# EAGLE design Genus_MainBoard_Dev v.1.0 (EAGLE 9.5.2)
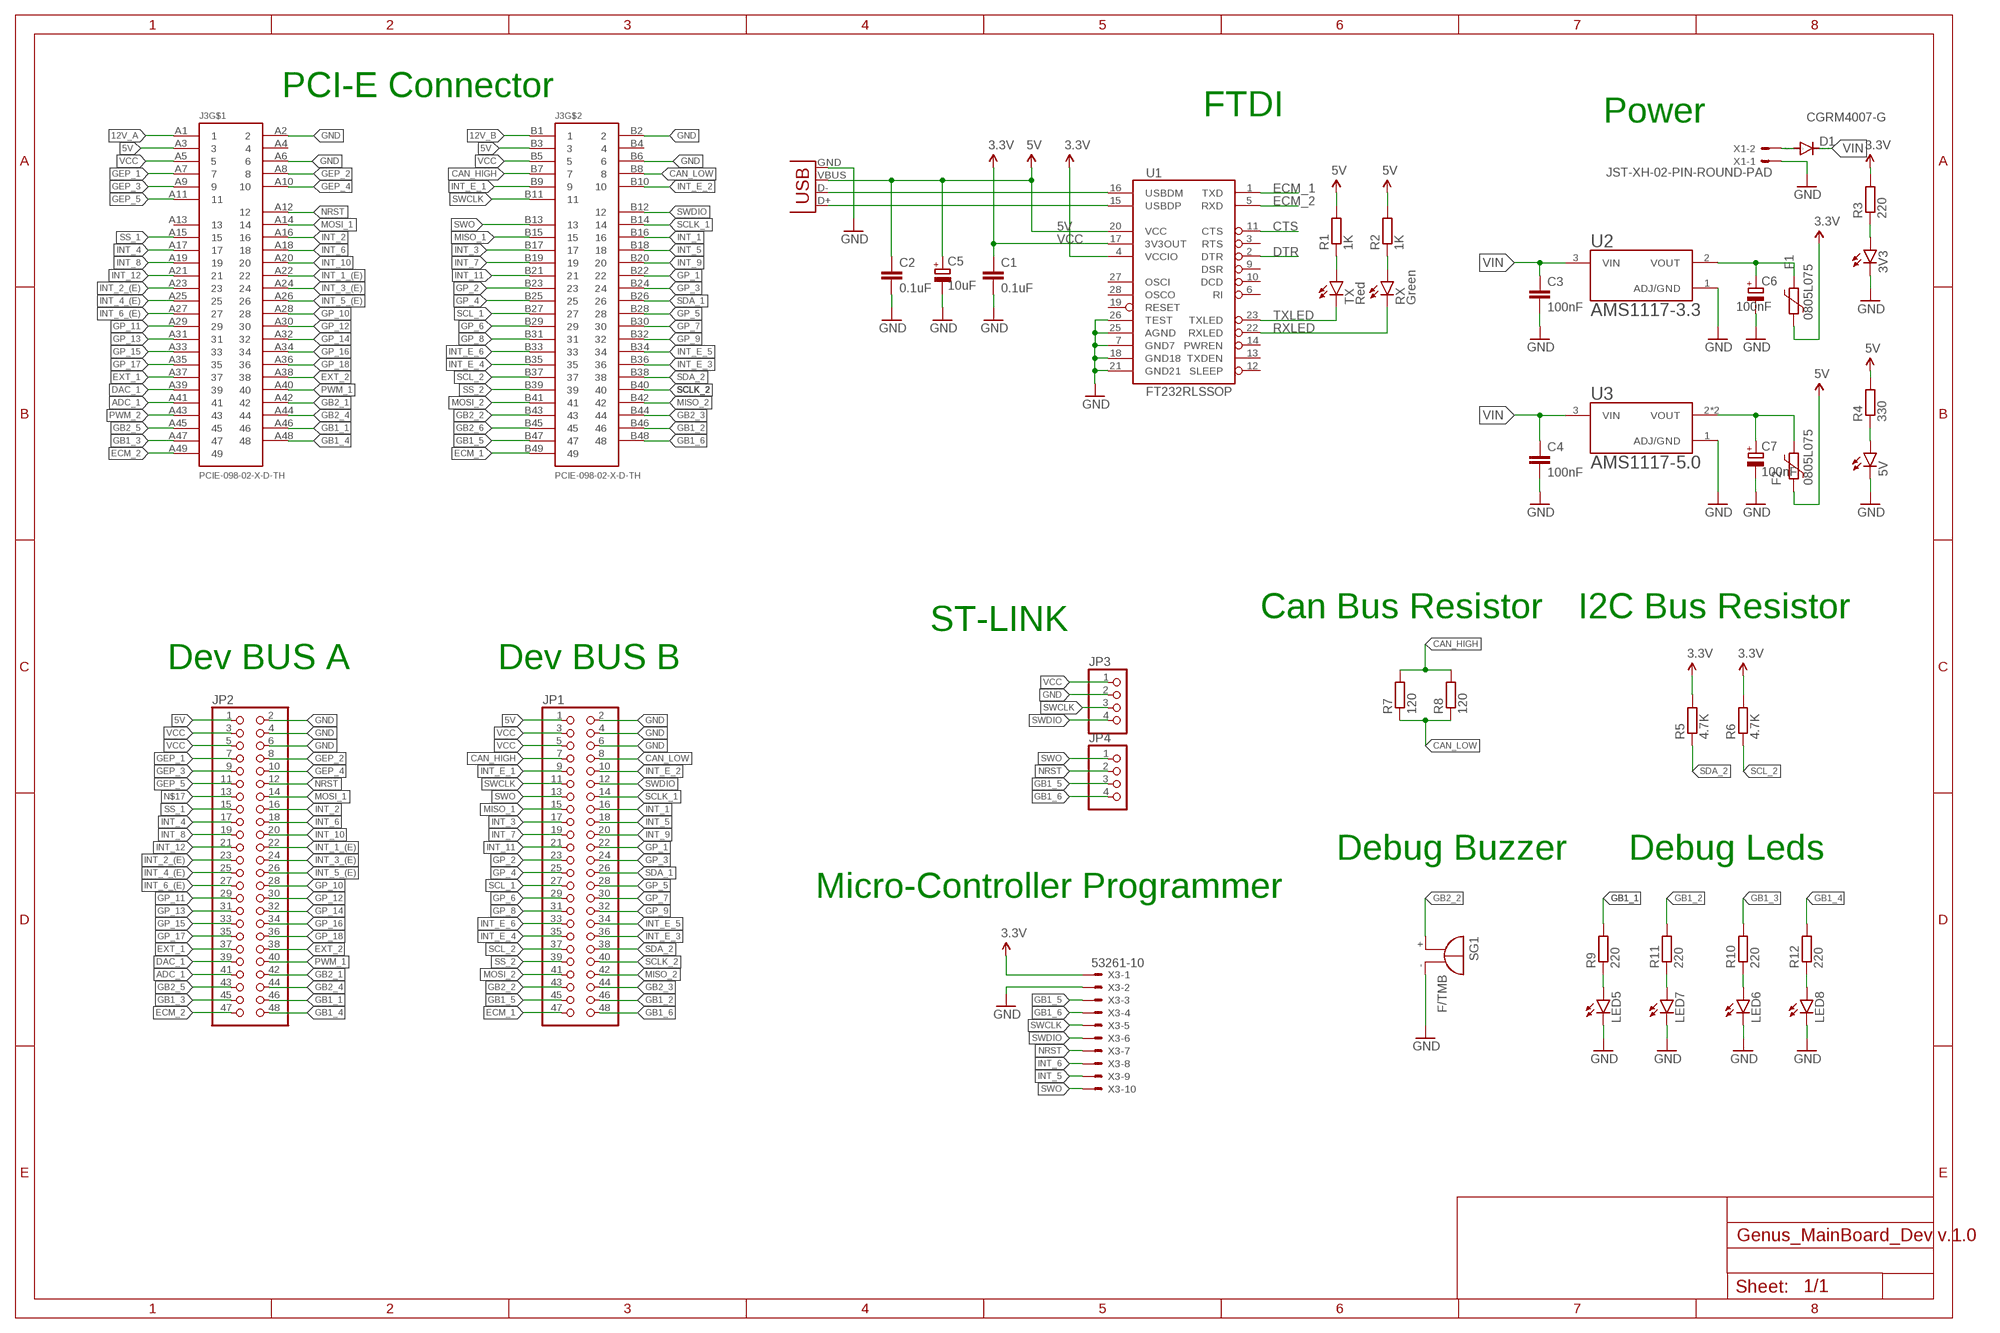
[diagram p0: schematic, sheet 1]

## Parts
3V3  LEDCHIPLED_0805  [CHIPLED_0805]
5V  LEDCHIPLED_0805  [CHIPLED_0805]
C1  0.1uF  C-EUC0805  [C0805]
C2  0.1uF  C-EUC0805  [C0805]
C3  100nF  C-EUC0805  [C0805]
C4  100nF  C-EUC0805  [C0805]
C5  10uF  CPOL-EUB  [PANASONIC_B]
C6  100nF  CPOL-EUB  [PANASONIC_B]
C7  100nF  CPOL-EUB  [PANASONIC_B]
D1  CGRM4007-G  [SOD-123_MINI-SMA]
F1  0805L075  [0805L]
F2  0805L075  [0805L]
J3  PCIE-098-02-X-D-TH  [PCIE-098-02-X-D-TH]
JP1  PINHD-2X24  [2X24]
JP2  PINHD-2X24  [2X24]
JP3  PINHD-1X4  [1X04]
JP4  PINHD-1X4  [1X04]
LED5  LEDCHIPLED_0805  [CHIPLED_0805]
LED6  LEDCHIPLED_0805  [CHIPLED_0805]
LED7  LEDCHIPLED_0805  [CHIPLED_0805]
LED8  LEDCHIPLED_0805  [CHIPLED_0805]
R1  1K  R-EU_R0805  [R0805]
R2  1K  R-EU_R0805  [R0805]
R3  220  R-EU_R0805  [R0805]
R4  330  R-EU_R0805  [R0805]
R5  4.7K  R-EU_R0805  [R0805]
R6  4.7K  R-EU_R0805  [R0805]
R7  120  R-EU_R0805  [R0805]
R8  120  R-EU_R0805  [R0805]
R9  220  R-EU_R0805  [R0805]
R10  220  R-EU_R0805  [R0805]
R11  220  R-EU_R0805  [R0805]
R12  220  R-EU_R0805  [R0805]
RX  Green  LEDCHIPLED_0805  [CHIPLED_0805]
SG1  F/TMB  [F/TMB]
TX  Red  LEDCHIPLED_0805  [CHIPLED_0805]
U1  FT232RLSSOP  [SSOP28DB]
U2  AMS1117-3.3  [SOT229P700X180-4N]
U3  AMS1117-5.0  [SOT229P700X180-4N]
X1  JST-XH-02-PIN-ROUND-PAD  [JST-XH-02-PACKAGE-ROUND-PAD]
X2  USB-SMD-NS  [USB-MINIB-NOSTOP]
X3  53261-10  [53261-10]

## Nets
5V: C2.1 C5.+ F2.2 J3.A3 J3.B3 JP1.1 JP2.1 R1.2 R2.2 R4.2 U1.20(VCC) X2.VBUS
12V_A: J3.A1
12V_B: J3.B1
ADC_1: J3.A41 JP2.41
CAN_HIGH: J3.B7 JP1.7 R7.2 R8.2
CAN_LOW: J3.B8 JP1.8 R7.1 R8.1
CTS: U1.11(CTS)
DAC_1: J3.A39 JP2.39
DTR: U1.2(DTR)
ECM_1: J3.B49 JP1.47 U1.1(TXD)
ECM_2: J3.A49 JP2.47 U1.5(RXD)
EXT_1: J3.A37 JP2.37
EXT_2: J3.A38 JP2.38
GB1_1: J3.A46 JP2.46 R9.2
GB1_2: J3.B46 JP1.46 R11.2
GB1_3: J3.A47 JP2.45 R10.2
GB1_4: J3.A48 JP2.48 R12.2
GB1_5: J3.B47 JP1.45 JP4.3 X3.3
GB1_6: J3.B48 JP1.48 JP4.4 X3.4
GB2_1: J3.A42 JP2.42
GB2_2: J3.B43 JP1.43 SG1.+
GB2_3: J3.B44 JP1.44
GB2_4: J3.A44 JP2.44
GB2_5: J3.A45 JP2.43
GB2_6: J3.B45
GEP_1: J3.A7 JP2.7
GEP_2: J3.A8 JP2.8
GEP_3: J3.A9 JP2.9
GEP_4: J3.A10 JP2.10
GEP_5: J3.A11 JP2.11
GND [power]: 3V3.C 5V.C C1.2 C2.2 C3.2 C4.2 C5.- C6.- C7.- J3.A2 J3.A6 J3.B2 J3.B6 JP1.2 JP1.4 JP1.6 JP2.2 JP2.4 JP2.6 JP3.2 LED5.C LED6.C LED7.C LED8.C SG1.- U1.7(GND7) U1.18(GND18) U1.21(GND21) U1.25(AGND) U1.26(TEST) U2.1(ADJ/GND) U3.1(ADJ/GND) X1.1 X2.GND X3.2
GP_1: J3.B22 JP1.22
GP_2: J3.B23 JP1.23
GP_3: J3.B24 JP1.24
GP_4: J3.B25 JP1.25
GP_5: J3.B28 JP1.28
GP_6: J3.B29 JP1.29
GP_7: J3.B30 JP1.30
GP_8: J3.B31 JP1.31
GP_9: J3.B32 JP1.32
GP_10: J3.A28 JP2.28
GP_11: J3.A29 JP2.29
GP_12: J3.A30 JP2.30
GP_13: J3.A31 JP2.31
GP_14: J3.A32 JP2.32
GP_15: J3.A33 JP2.33
GP_16: J3.A34 JP2.34
GP_17: J3.A35 JP2.35
GP_18: J3.A36 JP2.36
INT_1: J3.B16 JP1.16
INT_1_(E): J3.A22 JP2.22
INT_2: J3.A16 JP2.16
INT_2_(E): J3.A23 JP2.23
INT_3: J3.B17 JP1.17
INT_3_(E): J3.A24 JP2.24
INT_4: J3.A17 JP2.17
INT_4_(E): J3.A25 JP2.25
INT_5: J3.B18 JP1.18 X3.9
INT_5_(E): J3.A26 JP2.26
INT_6: J3.A18 JP2.18 X3.8
INT_6_(E): J3.A27 JP2.27
INT_7: J3.B19 JP1.19
INT_8: J3.A19 JP2.19
INT_9: J3.B20 JP1.20
INT_10: J3.A20 JP2.20
INT_11: J3.B21 JP1.21
INT_12: J3.A21 JP2.21
INT_E_1: J3.B9 JP1.9
INT_E_2: J3.B10 JP1.10
INT_E_3: J3.B36 JP1.36
INT_E_4: J3.B35 JP1.35
INT_E_5: J3.B34 JP1.34
INT_E_6: J3.B33 JP1.33
MISO_1: J3.B15 JP1.15
MISO_2: J3.B42 JP1.42
MOSI_1: J3.A14 JP2.14
MOSI_2: J3.B41 JP1.41
N$1: R1.1 TX.A
N$2: R2.1 RX.A
N$3: 3V3.A R3.1
N$4: 5V.A R4.1
N$5: LED5.A R9.1
N$6: LED6.A R10.1
N$7: LED7.A R11.1
N$8: LED8.A R12.1
N$9: D1.A X1.2
N$10: C6.+ F1.1 U2.2(VOUT)
N$11: C7.+ F2.1 U3.2(VOUT) U3.4(VOUT)
N$17: JP2.13
NRST: J3.A12 JP2.12 JP4.2 X3.7
PWM_1: J3.A40 JP2.40
PWM_2: J3.A43
RXLED: RX.C U1.22(RXLED)
SCL_1: J3.B27 JP1.27
SCL_2: J3.B37 JP1.37 R6.1
SCLK_1: J3.B14 JP1.14
SCLK_2: J3.B40 JP1.40
SDA_1: J3.B26 JP1.26
SDA_2: J3.B38 JP1.38 R5.1
SS_1: J3.A15 JP2.15
SS_2: J3.B39 JP1.39
SWCLK: J3.B11 JP1.11 JP3.3 X3.5
SWDIO: J3.B12 JP1.12 JP3.4 X3.6
SWO: J3.B13 JP1.13 JP4.1 X3.10
TXLED: TX.C U1.23(TXLED)
USB_D+: U1.15(USBDP) X2.D+
USB_D-: U1.16(USBDM) X2.D-
VCC: C1.1 F1.2 J3.A5 J3.B5 JP1.3 JP1.5 JP2.3 JP2.5 JP3.1 R3.2 R5.2 R6.2 U1.4(VCCIO) U1.17(3V3OUT) X3.1 ; supply symbol labelled 3.3V
VIN: C3.1 C4.1 D1.C U2.3(VIN) U3.3(VIN)
Unconnected: J3.A4 J3.A13 J3.B4 U1.3(RTS) U1.6(RI) U1.9(DSR) U1.10(DCD) U1.12(SLEEP) U1.13(TXDEN) U1.14(PWREN) U1.19(RESET) U1.27(OSCI) U1.28(OSCO)

## Notes on the sheet
- PCI-E Connector
- FTDI | Power
- Can Bus Resistor | I2C Bus Resistor
- ST-LINK
- Dev BUS A | Dev BUS B
- Debug Buzzer | Debug Leds
- Micro-Controller Programmer

## Library data of the parts
3V3 5V LED5-LED8 RX TX = led:LED: LED OSRAM: - CHIPLED LG R971, LG N971, LY N971, LG Q971, LY Q971, LO R971, LY R971 LH N974, LH R974 LS Q976, LO Q976, LY Q976 LO Q996 - Hyper CHIPLED LW Q18S LB Q993, LB Q99A, LB R99A - SideLED LS A670, LO A670, LY A670, LG A670, LP A670 LB A673, LV A673, LT A673, LW A673 LH A674 LY A675 LS A676, LA A676, LO A676, LY A676, LW A676 LS A679, LY A679, LG A679 - Hyper Micro SIDELED® LS Y876, LA Y876, LO Y876, LY Y876 LT Y87S - SmartLED LW L88C, LW L88S LB L89C, LB L89S, LG L890 LS L89K, LO L89K, LY L89K LS L896, LA L896, LO L896, LY L896 - TOPLED LS T670, LO T670, LY T670, LG T670, LP T670 LSG T670, LSP T670, LSY T670, LOP T670, LYG T670 LG T671, LOG T671, LSG T671 LB T673, LV T673, LT T673, LW T673 LH T674 LS T676, LA T676, LO T676, LY T676, LB T676, LH T676, LSB T676, LW T676 LB T67C, LV T67C, LT T67C, LS T67K, LO T67K, LY T67K, LW E67C LS E67B, LA E67B, LO E67B, LY E67B, LB E67C, LV E67C, LT E67C LW T67C LS T679, LY T679, LG T679 LS T770, LO T770, LY T770, LG T770, LP T770 LB T773, LV T773, LT T773, LW T773 LH T774 LS E675, LA E675, LY E675, LS T675 LS T776, LA T776, LO T776, LY T776, LB T776 LHGB T686 LT T68C, LB T68C - Hyper Mini TOPLED® LB M676 - Mini TOPLED Santana® LG M470 LS M47K, LO M47K, LY M47K Source: http://www.osram.convergy.de LUXEON: - LUMILED® LXK2-PW12-R00, LXK2-PW12-S00, LXK2-PW14-U00, LXK2-PW14-V00 LXK2-PM12-R00, LXK2-PM12-S00, LXK2-PM14-U00 LXK2-PE12-Q00, LXK2-PE12-R00, LXK2-PE12-S00, LXK2-PE14-T00, LXK2-PE14-U00 LXK2-PB12-K00, LXK2-PB12-L00, LXK2-PB12-M00, LXK2-PB14-N00, LXK2-PB14-P00, LXK2-PB14-Q00 LXK2-PR12-L00, LXK2-PR12-M00, LXK2-PR14-Q00, LXK2-PR14-R00 LXK2-PD12-Q00, LXK2-PD12-R00, LXK2-PD12-S00 LXK2-PH12-R00, LXK2-PH12-S00 LXK2-PL12-P00, LXK2-PL12-Q00, LXK2-PL12-R00 Source: www.luxeon.com KINGBRIGHT: KA-3528ASYC Source: www.kingbright.com
C1-C4 = rcl:C-EU: CAPACITOR, European symbol; SPICEPREFIX: C
C5-C7 = rcl:CPOL-EU: POLARIZED CAPACITOR, European symbol; SPICEPREFIX: C
D1 = diode:CGRM400*-G: Molded plasitc,JEDEC SOD-123/Mini SMA Source: Comchip CGRM4001-G.pdf
F1 F2 = polyfuse-smd_10:?: Polyfuse Resettable PTC Source: http://www.littelfuse.com/products/resettable-ptcs.aspx; MF: Littelfuse; MPN: 0805L075; OC_FARNELL: 1832105RL; OC_NEWARK: 18M4777
J3 = Z_BUS:PCIE-098-02-X-D-TH: PCI EXPRESS CARD CONNECTOR ,98 PINS.; AVAILABILITY: Unavailable; DESCRIPTION: 98 Position Female Connector PCI Express™ Gold 0.039 _1.00mm_ Black; MF: Samtec; MP: PCIE-098-02-F-D-TH; PACKAGE: None; PRICE: None
JP1 JP2 = pinhead:PINHD-2X24: PIN HEADER
JP3 JP4 = pinhead:PINHD-1X4: PIN HEADER
R1-R12 = rcl:R-EU_: RESISTOR, European symbol; SPICEPREFIX: R
SG1 = buzzer:F/TMB: BUZZER Source: Buerklin; OC_FARNELL: unknown; OC_NEWARK: unknown
U1 = SparkFun:FT232RL: USB UART FT232RL 4th Generation USB UART (USB <-> Serial) Controller. Spark Fun Electronics SKU : COM-00650
U2 = AMS1117-3.3:AMS1117-3.3: Sot223/Pkg 1-Amp 3.3-Volt Low Drop Out Voltage Regulatator; AVAILABILITY: Unavailable; DESCRIPTION: Sot223/Pkg 1-Amp 3.3-Volt Low Drop Out Voltage Regulatator; MF: Advanced Monolithic Systems; MP: AMS1117-3.3; PACKAGE: None; PRICE: None
U3 = AMS1117-5.0:AMS1117-5.0: Sot223/Pkg 1-Amp 5-Volt Low Drop Out Voltage Regulatator; AVAILABILITY: Unavailable; DESCRIPTION: 1A LOW DROPOUT VOLTAGE REGULATOR; MF: ams; MP: AMS1117-5.0; PACKAGE: SOT-223 ams; PRICE: None
X1 = JST-XH-Zenith:JST-XH-02-PIN: JST XH Connector 2 Pin Wire to board connector. Pitch: 2,54 mm, (0.100") Number of pins: 2 Created by Rembrandt Electronics www.rembrandtelectronics.com
X2 = SparkFun:USB: USB Connectors USB-B-PTH is fully proven SKU : PRT-00139 USB-miniB is fully proven SKU : PRT-00587 USB-A-PCB is untested. USB-A-H is throughly reviewed, but untested. Spark Fun Electronics SKU : PRT-00437 USB-B-SMT is throughly reviewed, but untested. Needs silkscreen touching up. USB-A-S has not been used/tested USB-MB-H has not been used/tested
X3 = con-zenith:53?-10: CONNECTOR wire to board 1.25 mm (.049 inch) pitch header; MF: MOLEX; OC_FARNELL: unknown; OC_NEWARK: unknown

## Net classes
1 power: width 0.254 mm

## Board
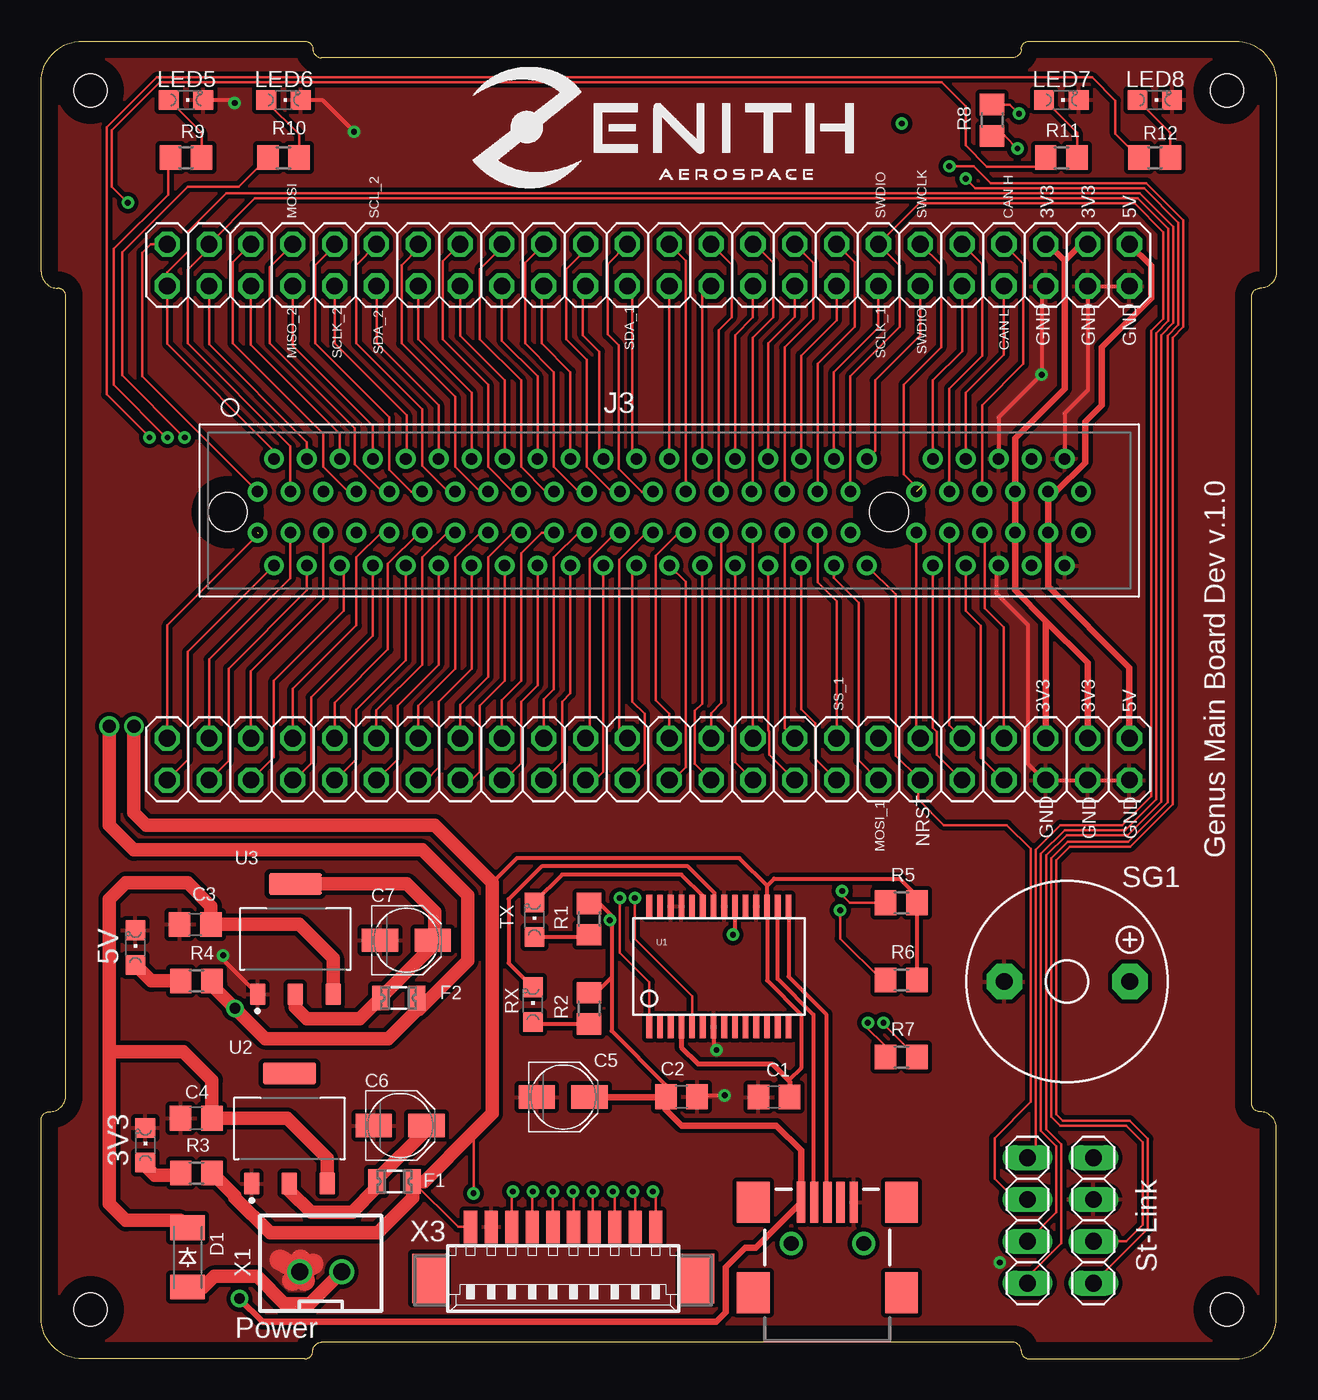
[diagram p1: board, top side]
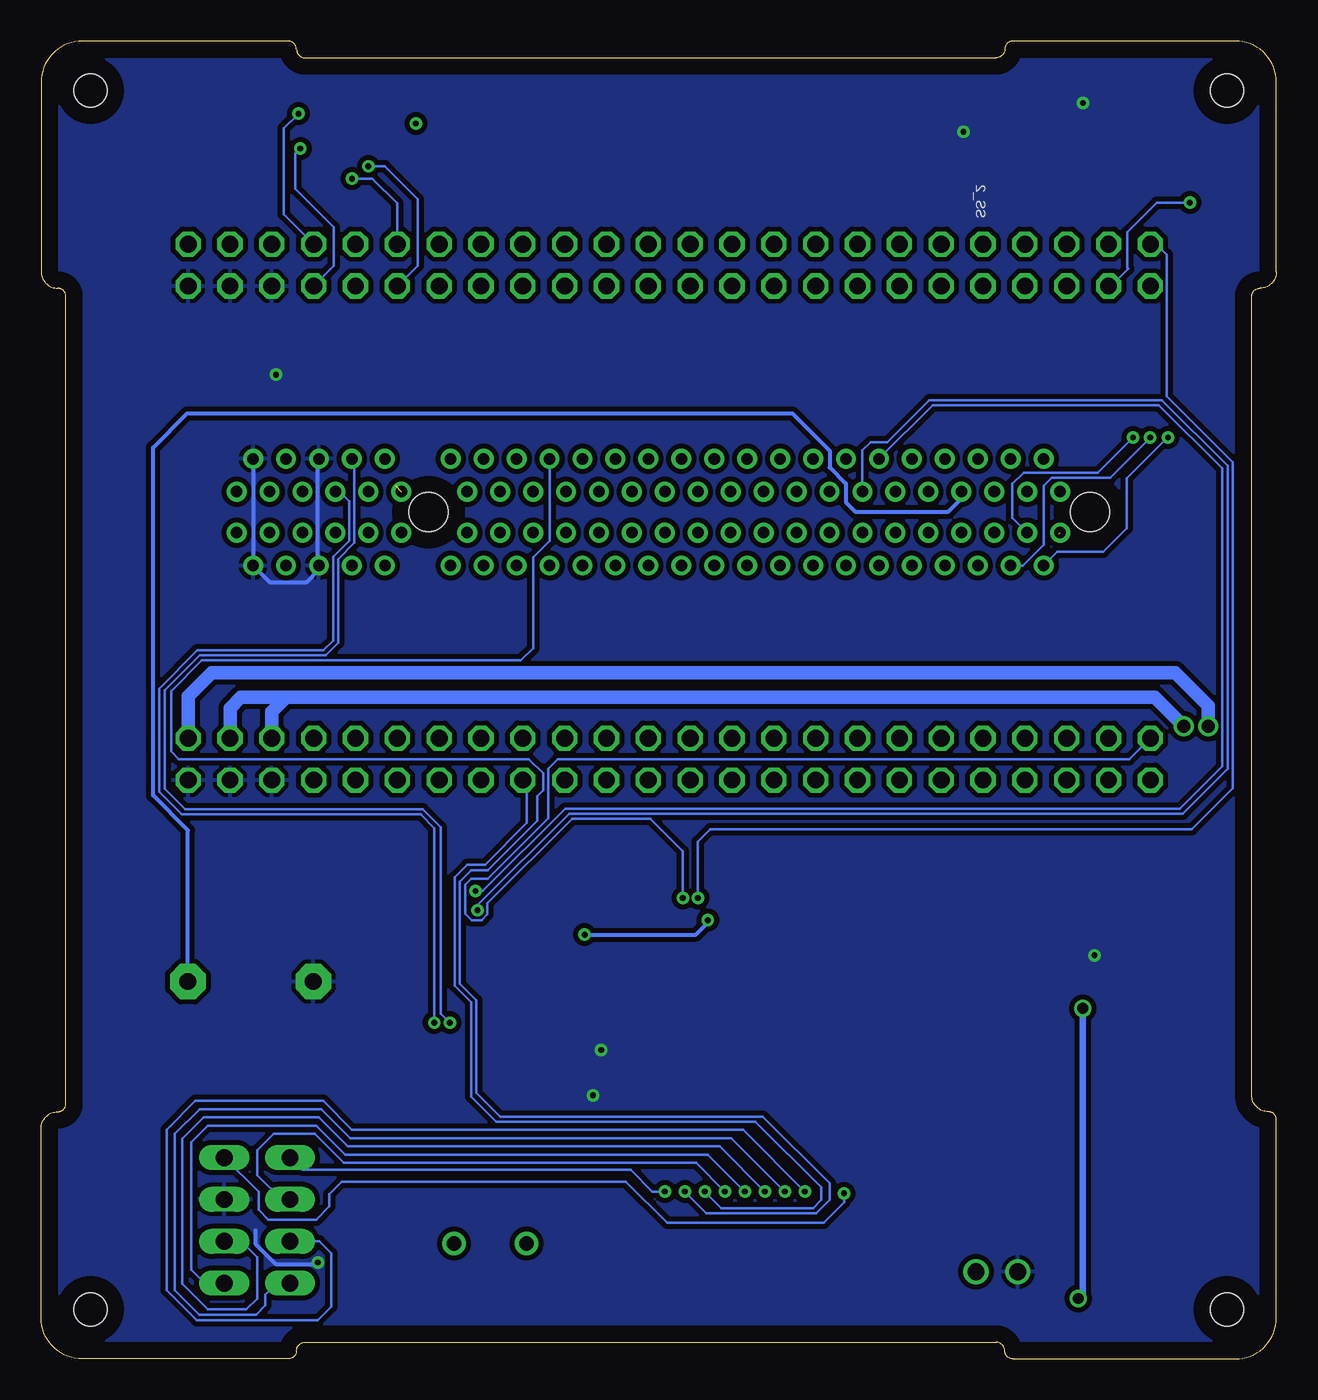
[diagram p2: board, bottom side, seen from below]

Size 75 x 80 mm. Coordinates in mm from the lower left corner, seen from the top.
Outline: 16,0 2.5,0 arc-90 0,2.5 0,14.5 arc-90 0.5,15 arc90 1.5,16 1.5,64.5 arc90 1,65 arc-90 0,66 0,77.5 arc-90 2.5,80 16,80 arc-90 16.5,79.5 arc90 17,79 59,79 arc90 59.5,79.5 arc-90 60,80 72.5,80 arc-90 75,77.5 75,66 arc-90 74,65 arc90 73.5,64.5 73.5,15.5 arc90 74,15 arc-90 75,14 75,2.5 arc-90 72.5,0 60,0 arc-90 59.5,0.5 arc90 59,1 17,1 arc90 16.5,0.5 arc-90 16,0
Copper layers (1*16): Top 0.035mm / dielectric 1.5mm / Bottom 0.035mm
Design rules "default": minimum track width 6mil, minimum drill 0.35mm, track to track 6mil, track to pad 6mil, pad to pad 6mil, via to via 6mil, smd to smd 6mil, copper to edge 40mil, drill to drill 6mil, minimum pad ring 10mil, minimum via ring 8mil, stop-mask expansion 4mil, vias tented up to drill 0mil, thermal gap 10mil
Holes 2 mm at 3,77 72,77 72,3 3,3

### Footprints (pad centres in the part's own frame; a part is rotated, then mirrored left to right if it is on the bottom)
CHIPLED_0805 = smd 1.2 x 1.2: A 0,-1.05; C 0,1.05
C0805 = smd 1.3 x 1.5: 1 -0.95,0; 2 0.95,0
PANASONIC_B = smd 2.2 x 1.4: + 1.6,0; - -1.6,0
SOD-123_MINI-SMA = smd 1.5 x 2.1: A 1.8,0; C -1.8,0
0805L = smd 1 x 1.5: 1 -1.1,0; 2 1.1,0
PCIE-098-02-X-D-TH = drill 0.7 pad 1.1: A1 25,-1.24; A2 24,-3.24; A3 23,-1.24; A4 22,-3.24; A5 21,-1.24; A6 20,-3.24; A7 19,-1.24; A8 18,-3.24; A9 17,-1.24; A10 16,-3.24; A11 15,-1.24; A12 12,-3.24; A13 11,-1.24; A14 10,-3.24; A15 9,-1.24; A16 8,-3.24; A17 7,-1.24; A18 6,-3.24; A19 5,-1.24; A20 4,-3.24; A21 3,-1.24; A22 2,-3.24; A23 1,-1.24; A24 0,-3.24; A25 -1,-1.24; A26 -2,-3.24; A27 -3,-1.24; A28 -4,-3.24; A29 -5,-1.24; A30 -6,-3.24; A31 -7,-1.24; A32 -8,-3.24; A33 -9,-1.24; A34 -10,-3.24; A35 -11,-1.24; A36 -12,-3.24; A37 -13,-1.24; A38 -14,-3.24; A39 -15,-1.24; A40 -16,-3.24; A41 -17,-1.24; A42 -18,-3.24; A43 -19,-1.24; A44 -20,-3.24; A45 -21,-1.24; A46 -22,-3.24; A47 -23,-1.24; A48 -24,-3.24; A49 -25,-1.24; B1 25,1.24; B2 24,3.24; B3 23,1.24; B4 22,3.24; B5 21,1.24; B6 20,3.24; B7 19,1.24; B8 18,3.24; B9 17,1.24; B10 16,3.24; B11 15,1.24; B12 12,3.24; B13 11,1.24; B14 10,3.24; B15 9,1.24; B16 8,3.24; B17 7,1.24; B18 6,3.24; B19 5,1.24; B20 4,3.24; B21 3,1.24; B22 2,3.24; B23 1,1.24; B24 0,3.24; B25 -1,1.24; B26 -2,3.24; B27 -3,1.24; B28 -4,3.24; B29 -5,1.24; B30 -6,3.24; B31 -7,1.24; B32 -8,3.24; B33 -9,1.24; B34 -10,3.24; B35 -11,1.24; B36 -12,3.24; B37 -13,1.24; B38 -14,3.24; B39 -15,1.24; B40 -16,3.24; B41 -17,1.24; B42 -18,3.24; B43 -19,1.24; B44 -20,3.24; B45 -21,1.24; B46 -22,3.24; B47 -23,1.24; B48 -24,3.24; B49 -25,1.24 | hole 2.35: 13.35,0; -26.81,0
2X24 = drill 1.016 octagon: 1 -27.94,-1.27; 2 -27.94,1.27; 3 -25.4,-1.27; 4 -25.4,1.27; 5 -22.86,-1.27; 6 -22.86,1.27; 7 -20.32,-1.27; 8 -20.32,1.27; 9 -17.78,-1.27; 10 -17.78,1.27; 11 -15.24,-1.27; 12 -15.24,1.27; 13 -12.7,-1.27; 14 -12.7,1.27; 15 -10.16,-1.27; 16 -10.16,1.27; 17 -7.62,-1.27; 18 -7.62,1.27; 19 -5.08,-1.27; 20 -5.08,1.27; 21 -2.54,-1.27; 22 -2.54,1.27; 23 0,-1.27; 24 0,1.27; 25 2.54,-1.27; 26 2.54,1.27; 27 5.08,-1.27; 28 5.08,1.27; 29 7.62,-1.27; 30 7.62,1.27; 31 10.16,-1.27; 32 10.16,1.27; 33 12.7,-1.27; 34 12.7,1.27; 35 15.24,-1.27; 36 15.24,1.27; 37 17.78,-1.27; 38 17.78,1.27; 39 20.32,-1.27; 40 20.32,1.27; 41 22.86,-1.27; 42 22.86,1.27; 43 25.4,-1.27; 44 25.4,1.27; 45 27.94,-1.27; 46 27.94,1.27; 47 30.48,-1.27; 48 30.48,1.27
1X04 = drill 1.016 long: 1 -3.81,0; 2 -1.27,0; 3 1.27,0; 4 3.81,0
R0805 = smd 1.3 x 1.5: 1 -0.95,0; 2 0.95,0
F/TMB = drill 1.016 pad 2.159 octagon: + 3.81,0; - -3.81,0
SSOP28DB = smd 0.348 x 1.397: 1 -4.225,-3.656; 2 -3.575,-3.656; 3 -2.925,-3.656; 4 -2.275,-3.656; 5 -1.625,-3.656; 6 -0.975,-3.656; 7 -0.325,-3.656; 8 0.325,-3.656; 9 0.975,-3.656; 10 1.625,-3.656; 11 2.275,-3.656; 12 2.925,-3.656; 13 3.575,-3.656; 14 4.225,-3.656; 15 4.225,3.656; 16 3.575,3.656; 17 2.925,3.656; 18 2.275,3.656; 19 1.625,3.656; 20 0.975,3.656; 21 0.325,3.656; 22 -0.325,3.656; 23 -0.975,3.656; 24 -1.625,3.656; 25 -2.275,3.656; 26 -2.925,3.656; 27 -3.575,3.656; 28 -4.225,3.656
SOT229P700X180-4N = smd 0.93 x 1.31: 1 -2.29,-3.345; 2 0,-3.345; 3 2.29,-3.345 | smd 3.24 x 1.31: 4 0,3.345
JST-XH-02-PACKAGE-ROUND-PAD = drill 1.016: 1 -1.27,0; 2 1.27,0
USB-MINIB-NOSTOP = smd 2.5 x 0.5: D+ 2.5,0; D- 2.5,0.8; GND 2.5,-1.6; ID 2.5,-0.8; VBUS 2.5,1.6 | smd 2.5 x 2: G1 -3,-4.5; G2 -3,4.5; G3 2.5,4.5; G4 2.5,-4.5 | drill 0.9 pad 0.8: H1 0,2.2 | drill 0.9 pad 0.787: H2 0,-2.2
53261-10 = smd 0.8 x 2: 1 5.625,-2.5; 2 4.375,-2.5; 3 3.125,-2.5; 4 1.875,-2.5; 5 0.625,-2.5; 6 -0.625,-2.5; 7 -1.875,-2.5; 8 -3.125,-2.5; 9 -4.375,-2.5; 10 -5.625,-2.5 | smd 2.1 x 3: S1 8.125,0.625; S2 -8.125,0.625

### Placement (x,y rotation side)
3V3  6.33,12.96 0 top
5V  5.72,24.96 0 top
C1  44.49,15.89 180 top
C2  38.88,15.91 0 top
C3  9.36,26.38 180 top
C4  9.41,14.61 180 top
C5  31.7,15.89 0 top
C6  21.8,14.16 0 top
C7  22.18,25.41 0 top
D1  8.88,6.16 270 top
F1  21.45,10.77 0 top
F2  21.7,21.91 0 top
J3  38.13,51.41 0 top
JP1  38.13,66.41 180 top
JP2  38.13,36.41 180 top
JP3  63.88,8.4 270 top
JP4  59.88,8.4 270 top
LED5  8.79,76.43 270 top
LED6  14.71,76.43 270 top
LED7  61.94,76.43 270 top
LED8  67.61,76.43 270 top
R1  33.27,26.7 90 top
R2  33.27,21.27 90 top
R3  9.43,11.28 0 top
R4  9.43,22.95 0 top
R5  52.23,27.68 0 top
R6  52.23,23 0 top
R7  52.23,18.32 0 top
R8  57.73,75.21 90 top
R9  8.79,72.93 180 top
R10  14.71,72.93 180 top
R11  61.94,72.93 180 top
R12  67.61,72.93 180 top
RX  29.86,21.5 0 top
SG1  62.28,22.91 0 top
TX  29.95,26.66 0 top
U1  41.15,23.82 0 top
U2  15.07,13.98 0 top
U3  15.44,25.48 0 top
X1  16.98,5.29 0 top
X2  47.73,7 90 top
X3  31.7,5.5 180 top

### Tracks (layer width: path | path; a pad name or v marks a point on that pad's centre or on a via)
5V  (via drill 0.35, 0.65, 0.8)
  Top 0.254: 61.38,52.65 J3.B3 | 46.17,9.54 X2.VBUS | R1.2 33.9,27.64 34.63,26.91 34.63,26.52 | 34.63,26.52 34.63,23.16 | 34.63,23.16 33.7,22.23 R2.2 | 34.63,23.16 34.63,19.91 37.92,16.61 37.92,15.62 37.92,15.12 | U1.20 42.12,25.87 v42,25.75 | v34.53,26.63 34.63,26.52
  Top 0.406: JP2.1 66.08,41.97 61.13,46.91 J3.A3 J3.B3 61.61,52.65 63.38,54.42 63.38,56.91 64.39,57.91 64.39,61.41 67.39,64.41 67.39,66.36 JP1.1 | C5.+ 37.65,15.89 37.92,15.62 C2.1 37.91,15.89 | 37.92,15.12 38.88,14.15 44.63,14.15 46.13,12.65 X2.VBUS 43.38,6.75 42.75,6.75 41.55,5.55 41.55,2.81 40.99,2.25 13.44,2.25 v12.04,3.65
  Top 0.813: R4.2 10.63,22.68 10.63,22.41 v11.76,21.28 13.6,19.44 21.08,19.44 22.8,21.16 22.8,21.22 | 22.8,21.22 F2.2 | v4.13,38.41 4.13,32.41 5.63,30.91 23.14,30.91 25.89,28.16 25.89,24.16 22.95,21.22 22.8,21.22
  Bottom 0.254: v42,25.75 35.25,25.75 34.53,26.47 v34.53,26.63
  Bottom 0.406: v11.76,21.28 11.76,3.93 v12.04,3.65
  Bottom 0.813: v4.13,38.41 4.13,39.66 6.13,41.66 64.64,41.66 66.08,40.22 JP2.1
ADC_1
  Top 0.152: JP2.41 15.28,40.67 19.14,44.53 19.14,48.66 20.64,50.16 J3.A41
CAN_HIGH  (via drill 0.35)
  Top 0.152: JP1.7 59.63,66.5 59.63,60.41 57.13,57.91 J3.B7 | R7.2 51.13,20.36 v51.13,20.41 | R8.2 58.82,76.16 v59.37,75.6
  Bottom 0.152: v51.13,20.41 51.13,32.22 51.96,33.05 66.46,33.05 67.83,34.42 67.83,40.69 65.51,43.01 57.86,43.01 57.27,43.6 57.27,48.69 56.3,49.66 56.3,52.06 56.88,52.65 J3.B7 | v59.37,75.6 60.27,74.71 60.27,69.49 JP1.7
CAN_LOW  (via drill 0.35)
  Top 0.152: JP1.8 58.45,60.98 56.13,58.66 J3.B8 | R7.1 51.27,18.96 50.01,20.23 v50.19,20.41 | v59.27,73.48 58.49,74.26 R8.1
  Bottom 0.152: v50.19,20.41 50.74,20.96 50.74,32.26 51.84,33.35 66.25,33.35 67.5,34.6 67.5,40.59 65.39,42.7 57.73,42.7 56.97,43.47 56.97,48.56 55.99,49.53 55.99,54.5 J3.B8 | v59.27,73.48 59.59,73.16 59.59,71.05 57.23,68.69 57.23,66.36 JP1.8
DAC_1
  Top 0.152: JP2.39 17.82,39.84 21.05,43.07 21.05,48.26 22.96,50.16 J3.A39
ECM_1  (via drill 0.35)
  Top 0.152: J3.B49 6.13,59.65 6.13,67.16 6.66,67.67 JP1.47 | U1.1 36.92,22.87 35.13,24.66 v35.13,27.98
  Bottom 0.152: v35.13,27.98 35.13,31.41 34.38,32.16 5.13,32.16 2.65,34.64 2.65,54.42 6.66,58.43 6.66,67.05 7.29,67.67 JP1.47
ECM_2  (via drill 0.35)  (1 unrouted)
  Top 0.152: JP2.47 7.66,44.53 13.21,50.09 | U1.5 39.52,22.02 36.04,25.5 v36.04,27.98
  Bottom 0.152: v36.04,27.98 36.04,30.81 38.02,32.78 42.77,32.78 47.9,27.65 47.9,26.98 48.26,26.63 48.86,26.63 49.26,27.03 49.26,28.78 48.88,29.16 47.88,29.16 44.22,32.82 44.22,35.82 43.63,36.41 8.93,36.41 JP2.47
EXT_1
  Top 0.152: JP2.37 20.36,39.38 23.14,42.16 23.14,48.66 24.64,50.16 J3.A37
EXT_2
  Top 0.152: J3.A38 24.14,42.16 21.64,39.66 21.64,36.41 JP2.38
GB1_1  (via drill 0.35)
  Top 0.152: JP2.46 11.38,36.33 11.38,41.91 16.14,46.66 J3.A46 | R9.2 7.7,72.79 7.7,70.69 4.4,67.38 4.4,59.13 7.59,55.94 v7.67,55.94
  Bottom 0.152: v7.67,55.94 10.1,53.5 13.63,53.5 14.14,53 14.14,49.42 15.39,48.16 J3.A46
GB1_2  (via drill 0.35)
  Top 0.152: J3.B46 16.14,55.66 10.2,61.59 JP1.46 | R11.2 60.43,72.37 57.42,72.37 56.12,73.67 56.12,76.06 54.68,77.5 7.19,77.5 4.28,74.6 4.28,71.17 v5.26,70.2
  Bottom 0.152: v5.26,70.2 7.27,70.2 9.06,68.41 9.06,66.23 9.01,66.18 10.06,65.14 JP1.46
GB1_3  (via drill 0.35)
  Top 0.152: JP2.45 10.2,42.47 15.13,47.41 J3.A47 | R10.2 12,71.16 8.9,71.16 4.91,67.17 4.91,59.71 8.69,55.94 v8.71,55.94
  Bottom 0.152: v8.71,55.94 10.84,53.81 15.35,53.81 16.04,53.12 16.04,51.07 J3.A47
GB1_4  (via drill 0.35)
  Top 0.152: JP2.48 8.88,36.37 8.88,42.91 J3.A48 | R12.2 65.22,74.37 65.22,76.38 63.8,77.81 7.01,77.81 3.97,74.77 3.97,58.56 6.58,55.95 v6.58,55.94
  Bottom 0.152: v6.58,55.94 6.62,55.94 9.1,53.45 9.1,50.42 10.53,49 13.3,49 J3.A48
GB1_5  (via drill 0.35)
  Top 0.152: J3.B47 15.13,55.41 8.88,61.66 8.88,66.11 10.2,67.42 JP1.45 12.98,70.46 66.58,70.46 68.44,68.6 68.44,63.03 67.69,62.28 67.69,33.96 65.83,32.1 62.13,32.1 60.69,30.66 60.69,13.85 61.63,12.9 61.63,12.63 61.64,12.62 61.64,8.89 JP4.3 | X3.3 28.57,10.09 v28.64,10.15
  Bottom 0.152: v28.64,10.15 32.38,13.9 56.13,13.9 57.88,15.65 65.64,15.65 67.39,13.9 67.39,4.16 65.57,2.34 58.2,2.34 57.38,3.15 57.38,6.41 58.12,7.13 JP4.3
GB1_6  (via drill 0.35)
  Top 0.152: J3.B48 14.13,55.15 7.66,61.62 JP1.48 7.66,65.96 8.93,67.23 8.93,68.45 11.24,70.77 66.71,70.77 68.75,68.73 68.75,62.9 68,62.15 68,33.83 65.96,31.8 62.26,31.8 61.02,30.56 61.02,13.95 61.94,13.03 61.94,7.03 59.88,4.97 JP4.4 | X3.4 29.82,10.13 v29.85,10.15
  Bottom 0.152: v29.85,10.15 33.1,13.4 56.23,13.4 57.98,15.15 65.39,15.15 66.89,13.65 66.89,4.16 65.41,2.68 61.95,2.68 61.38,3.25 61.38,3.9 60.7,4.59 JP4.4
GB2_1
  Top 0.152: J3.A42 20.14,43.91 16.39,40.16 16.39,36.16 15.37,35.13 JP2.42
GB2_2
  Top 0.152: JP1.43 11.63,66.58 11.63,61.66 17.14,56.16 17.14,54.16 18.64,52.65 J3.B43
  Bottom 0.254: SG1.+ 66.09,32.09 68.21,34.2 68.21,55.33 66.14,57.41 29.39,57.41 27.12,55.14 27.12,54.12 26.15,53.14 26.15,52.01 25.58,51.44 19.91,51.44 19.14,52.22 J3.B43
GB2_3
  Top 0.152: J3.B44 18.14,56.16 12.73,61.55 JP1.44
GB2_4
  Top 0.152: JP2.44 14.13,36.53 14.13,41.16 18.39,45.41 18.39,47.91 J3.A44
GB2_5
  Top 0.152: J3.A45 17.14,46.16 12.73,41.76 JP2.43
GEP_1
  Top 0.152: J3.A7 57.3,50 57.3,45.57 58.45,44.42 JP2.7
GEP_2
  Top 0.152: J3.A8 56.13,45.41 57.03,44.52 57.03,36.51 58.41,35.13 JP2.8
GEP_3
  Top 0.152: JP2.9 55.13,38.45 J3.A9
GEP_4
  Top 0.152: J3.A10 54.13,38.32 54.37,38.09 54.37,36.68 JP2.10
GEP_5
  Top 0.152: J3.A11 53.13,37.91 JP2.11
GND  (via drill 0.35)
  Top 0.254: J3.B6 58.13,57.16 v60.73,59.75 v60.74,59.75 60.74,64.89 JP1.6 | J3.B2 62.13,57.4 63.53,58.8 JP1.4 JP1.2 | JP2.2 JP2.6 60.88,35.13 | 60.88,35.13 60.41,35.13 | J3.A6 57.98,48.01 57.98,46.49 59.88,44.58 59.88,36.13 60.88,35.13 | v58.2,5.85 58.2,5.9 | U1.7 40.82,18.93 v41,18.75 | C2.2 39.91,16 v41.5,16 | v11.05,24.5 11.05,24.23 U3.1 | LED6.C 17.07,76.43 v19,74.5 | LED5.C 11.57,76.43 v11.75,76.25
  Top 1.27: 14.5,6 X1.1 | 15.75,6 X1.1 | X1.1 15.25,4.75 | X1.1 16,4.75 | X1.1 16.5,5.75
  Bottom 0.254: J3.B2 J3.A2 61.12,47.16 58.88,47.16 58.13,47.91 J3.A6 58.23,48.27 58.23,54.55 J3.B6 | 62,7.79 62,7 60.75,5.75 58.3,5.75 v58.2,5.85
  pour Top (isolate 0.254): 16,80 arc-90 16.5,79.5 arc90 17,79 59,79 arc90 59.5,79.5 arc-90 60,80 73,80 arc-90 75,78 75,66 arc-90 74,65 73.75,65 arc90 73.5,64.75 73.5,15.75 arc90 74.25,15 74.5,15 arc-90 75,14.5 75,1.75 arc-90 73.25,0 60,0 arc-90 59.5,0.5 arc90 59,1 17,1 arc90 16.5,0.5 arc-90 16,0 2.25,0 arc-90 0,2.25 0,14.75 arc-90 0.25,15 1,15 arc90 1.5,15.5 1.5,64.5 arc90 1,65 0.75,65 arc-90 0,65.75 0,78 arc-90 2,80
  pour Bottom (isolate 0.305): 2.25,80 16,80 arc-90 16.5,79.5 16.5,79.25 arc90 16.75,79 18.75,79 59,79 arc90 59.5,79.5 arc-90 60,80 72.5,80 arc-90 75,77.5 75,75.25 75,66 75,65.75 arc-90 74.25,65 74,65 arc90 73.5,64.5 73.5,63.5 73.5,15.25 arc90 73.75,15 74.25,15 arc-90 75,14.25 75,13 75,2.25 arc-90 72.75,0 67.25,0 60,0 arc-90 59.5,0.5 arc90 59,1 58.25,1 17,1 arc90 16.5,0.5 arc-90 16,0 15.5,0 2.5,0 arc-90 0,2.5 0,3 0,14.75 arc-90 0.25,15 0.5,15 arc90 1.5,16 1.5,16.75 1.5,64.5 arc90 1,65 0.5,65 arc-90 0,65.5 0,67 0,77.75 arc-90
GP_1
  Top 0.152: 40.66,65.12 JP1.22 40.13,64.59 J3.B22
GP_2
  Top 0.152: 38.88,52.65 J3.B23 39.13,66.67 JP1.23
GP_3
  Top 0.152: J3.B24 JP1.24
GP_4
  Top 0.152: J3.B25 36.46,52.65 35.05,54.05 35.05,61.53 34.38,62.19 34.38,66.47 JP1.25
GP_5
  Top 0.152: J3.B28 33.88,54.9 33.88,61.16 32.88,62.16 32.88,64.97 JP1.28
GP_6
  Top 0.152: JP1.29 29.39,66.55 29.39,61.66 31.14,59.91 31.14,54.16 32.65,52.65 J3.B29
GP_7
  Top 0.152: J3.B30 32.13,59.91 30.39,61.66 30.39,65 JP1.30
GP_8
  Top 0.152: JP1.31 27.98,67.5 26.64,66.16 26.64,61.91 29.14,59.41 29.14,54.16 30.64,52.65 J3.B31
GP_9
  Top 0.152: JP1.32 27.98,61.81 30.14,59.66 J3.B32
GP_10
  Top 0.152: JP2.28 33.62,35.13 34.13,35.66 J3.A28
GP_11
  Top 0.152: JP2.29 30.52,40.03 31.14,40.66 31.14,48.66 32.65,50.16 J3.A29
GP_12
  Top 0.152: J3.A30 32.13,40.41 31.64,39.91 31.64,36.26 JP2.30
GP_13
  Top 0.152: JP2.31 27.98,39.99 29.14,41.16 29.14,48.91 30.39,50.16 J3.A31
GP_14
  Top 0.152: J3.A32 30.14,40.91 29.14,39.91 29.14,36.16 28.11,35.13 JP2.32
GP_15
  Top 0.152: JP2.33 25.43,39.7 27.14,41.41 27.14,48.66 28.64,50.16 J3.A33
GP_16
  Top 0.152: J3.A34 28.14,41.16 26.64,39.66 26.64,35.66 26.11,35.13 JP2.34
GP_17
  Top 0.152: JP2.35 22.89,39.66 25.14,41.91 25.14,48.66 26.64,50.16 J3.A35
GP_18
  Top 0.152: J3.A36 26.14,41.91 24.14,39.91 24.14,35.91 23.36,35.13 JP2.36
INT_1
  Top 0.152: J3.B16 46.13,60.91 48.3,63.06 JP1.16
INT_1_(E)
  Top 0.152: J3.A22 40.13,39.79 39.68,39.34 39.68,36.13 JP2.22
INT_2
  Top 0.152: J3.A16 46.13,39.45 47,38.59 47,36.43 JP2.16
INT_2_(E)
  Top 0.152: JP2.23 38.13,39.16 37.3,39.99 37.3,48.76 38.71,50.16 J3.A23
INT_3
  Top 0.152: JP1.17 46.88,66.55 46.88,63.16 45.13,61.41 J3.B17
INT_3_(E)
  Top 0.152: J3.A24 39.13,47.16 39.13,35.91 38.37,35.13 JP2.24
INT_4
  Top 0.152: JP2.17 45.13,38.3 J3.A17
INT_4_(E)
  Top 0.152: JP2.25 35.09,38.17 35.09,48.53 36.73,50.16 J3.A25
INT_5  (via drill 0.35)
  Top 0.152: JP1.18 45.76,63.27 44.13,61.66 J3.B18 | X3.9 36.07,10.01 v35.92,10.15
  Bottom 0.152: v35.92,10.15 34.62,8.85 27.94,8.85 27.14,9.65 27.14,10.65 31.19,14.71 47.13,14.71 48.58,16.16 48.58,21.78 49.58,22.78 49.58,28.96 48.88,29.66 47.88,29.66 44.88,32.66 44.88,34.16 44.52,34.52 44.52,35.55 45.38,36.41 66.64,36.41 67.11,36.88 67.11,40.54 65.26,42.4 45.89,42.4 45.13,43.16 45.13,48.66 44.13,49.66 J3.B18
INT_5_(E)
  Top 0.152: JP2.26 36.63,36.17 36.63,39.16 35.88,39.91 35.88,47.91 J3.A26
INT_6  (via drill 0.35)
  Top 0.152: J3.A18 44.13,38.16 44.21,38.09 44.21,36.68 JP2.18 | X3.8 34.82,10.04 v34.71,10.15
  Bottom 0.152: v34.71,10.15 33.71,9.15 28.14,9.15 27.64,9.65 27.64,10.4 31.64,14.4 47.38,14.4 48.88,15.9 48.88,21.66 49.88,22.66 49.88,29.25 49.15,29.99 48.05,29.99 45.51,32.53 45.51,34.88 JP2.18
INT_6_(E)
  Top 0.152: J3.A27 34.88,49.91 34.63,49.91 33.3,48.57 33.3,37.92 JP2.27
INT_7
  Top 0.152: 42.96,52.65 J3.B19 43.22,52.73 43.22,61.98 44.46,63.23 44.46,66.55 43.33,67.67 JP1.19
INT_8
  Top 0.152: JP2.19 43.22,50.09 J3.A19
INT_9
  Top 0.152: J3.B20 42.13,62.16 43.22,63.23 JP1.20
INT_10
  Top 0.152: JP2.20 42.13,36.22 J3.A20
INT_11
  Top 0.152: 40.96,52.65 J3.B21 41.13,62.44 41.92,63.23 41.92,66.43 JP1.21
INT_12
  Top 0.152: JP2.21 40.67,39.2 41.3,39.82 41.3,50 J3.A21
INT_E_1
  Top 0.152: JP1.9 57.13,66.45 57.13,60.91 55.13,58.91 J3.B9
INT_E_2
  Top 0.152: J3.B10 54.13,59.41 55.91,61.19 JP1.10
INT_E_3
  Top 0.152: JP1.36 22.89,61.9 26.14,58.66 J3.B36
INT_E_4
  Top 0.152: JP1.35 22.89,67.42 21.89,66.41 21.89,61.66 25.14,58.41 25.14,54.16 26.64,52.65 J3.B35
INT_E_5
  Top 0.152: JP1.34 25.43,62.1 28.14,59.41 J3.B34
INT_E_6
  Top 0.152: JP1.33 24.39,66.62 24.39,61.91 27.14,59.16 27.14,54.16 28.64,52.65 J3.B33
MISO_1
  Top 0.152: JP1.15 49.38,66.58 49.38,62.66 47.13,60.41 J3.B15
MISO_2
  Top 0.152: JP1.42 15.28,61.52 20.14,56.66 J3.B42
MOSI_1
  Top 0.152: J3.A14 48.13,47.41 49.63,45.91 49.63,36.34 JP2.14
MOSI_2
  Top 0.152: JP1.41 13.88,66.28 13.88,61.66 19.05,56.49 19.05,54.3 20.71,52.65 J3.B41
N$1
  Top 0.254: R1.1 33.12,25.61 TX.A
N$2
  Top 0.254: R2.1 29.98,20.32 RX.A
N$3
  Top 0.813: 3V3.A 6.33,11.71 6.88,11.15 8.36,11.15 R3.1
N$4
  Top 0.813: R4.1 6.7,22.95 5V.A
N$5
  Top 0.152: LED5.A 9.74,74.43 R9.1
N$6
  Top 0.152: LED6.A 13.66,76.33 15.66,74.33 R10.1
N$7
  Top 0.152: LED7.A 62.89,74.43 R11.1
N$8
  Top 0.152: LED8.A 68.49,74.5 68.5,74.5 68.56,74.44 R12.1
N$9
  Top 0.813: X1.2 16.32,3.35 14.75,3.35 13.11,5 10.5,5 9.86,4.36 D1.A
N$10
  Top 0.813: C6.+ 23.39,13.91 20.36,10.88 F1.1 20.36,10.38 18.89,8.9 16.39,8.9 15.07,10.21 U2.2
N$11
  Top 0.813: U3.2 15.44,21.36 16.14,20.66 19.34,20.66 F2.1 23.89,25.2 23.89,25.52 | U3.4 22.21,28.83 23.89,27.16 23.89,25.52 | 23.89,25.52 C7.+
N$12  (via drill 0.35)
  other vias: 52.25,75
NRST  (via drill 0.35)
  Top 0.152: JP2.12 53.24,35.27 | 53.24,35.27 51.88,36.62 51.88,46.41 J3.A12 | 53.24,35.27 53.24,33.97 54.8,32.41 58.63,32.41 60.08,30.96 60.08,15.6 57.88,13.4 57.88,10.93 59.13,9.68 JP4.2 | 33.57,10.08 v33.49,10.15 33.49,8.08 X3.7
  Bottom 0.152: v33.49,10.15 35.24,11.9 56.63,11.9 58.38,13.65 60.88,13.65 61.88,12.65 61.88,11.15 60.41,9.68 JP4.2
PWM_1
  Top 0.152: J3.A40 22.14,42.41 19.14,39.41 19.14,36.41 17.86,35.13 JP2.40
RXLED
  Top 0.254: U1.22 40.88,27.54 40.88,28.29 39.26,29.91 30.39,29.91 28.39,27.91 28.39,24.02 RX.C
SCL_1
  Top 0.152: JP1.27 33.05,67.33 31.89,66.16 31.89,61.91 33.13,60.66 33.13,54.16 34.65,52.65 J3.B27
SCL_2  (via drill 0.35)
  Top 0.152: JP1.37 20.36,67.62 19.14,66.41 19.14,61.66 23.14,57.66 23.14,54.22 24.71,52.65 J3.B37 | v48.51,27.23 48.51,25.52 51.02,23 R6.1
  Bottom 0.152: v48.51,27.23 48.51,27.53 42.94,33.1 5.69,33.1 2.96,35.83 2.96,54.21 6.96,58.21 21.08,58.21 23.64,55.66 24.64,55.66 25.14,55.16 J3.B37
SCLK_1
  Top 0.152: J3.B14 48.13,59.91 50.84,62.6 JP1.14
SCLK_2
  Top 0.152: J3.B40 22.19,54.7 22.19,57.28 17.82,61.66 JP1.40
SDA_1
  Top 0.152: JP1.26 35.88,64.84 35.88,54.9 J3.B26
SDA_2  (via drill 0.35)
  Top 0.152: JP1.38 20.39,65.11 20.39,61.66 24.14,57.91 J3.B38 | R5.1 49.1,27.68 48.63,28.16 v48.63,28.41
  Bottom 0.152: v48.63,28.41 48.19,28.41 43.19,33.41 5.88,33.41 3.3,35.99 3.3,54.07 7.13,57.91 20.88,57.91 J3.B38
SS_1
  Top 0.152: JP2.15 48.3,45.99 47.13,47.16 J3.A15
SS_2
  Top 0.152: JP1.39 17.82,67.58 16.64,66.41 16.64,61.66 21.14,57.16 21.14,53.97 22.46,52.65 J3.B39
SWCLK  (via drill 0.35)  (1 unrouted)
  Top 0.152: JP1.11 54.63,66.42 54.63,61.41 52.38,59.16 52.38,53.71 53.29,52.8 53.52,53.02 | X3.5 v31.07,10.15 v31.06,10.15 | JP3.3 65.86,7.13 66.89,8.15 66.89,13.15 65.89,14.15 61.88,14.15 61.33,14.71 61.33,30.41 62.33,31.41 66,31.41 68.39,33.79 68.39,62.11 69.05,62.78 69.05,68.99 66.97,71.07 56.72,71.07 v56.13,71.66
  Bottom 0.152: v31.06,10.15 33.81,12.9 56.38,12.9 58.13,14.65 65.14,14.65 66.44,13.35 66.44,4.55 64.89,3 62.54,3 61.88,3.65 61.88,6.16 62.87,7.13 JP3.3 | v56.13,71.66 54.88,71.66 53.38,70.14 JP1.11
SWDIO  (via drill 0.35)
  Top 0.152: J3.B12 50.63,55.15 50.63,59.41 53.38,62.15 JP1.12 | X3.6 32.32,10.11 v32.28,10.15 | JP3.4 67.19,7.9 67.19,13.35 66.08,14.46 62.01,14.46 61.63,14.84 61.63,30.28 62.46,31.1 66.12,31.1 68.69,33.67 68.69,61.99 69.35,62.65 69.35,69.12 67.1,71.37 57.67,71.37 56.63,72.41 v55.13,72.41
  Bottom 0.152: v32.28,10.15 34.53,12.4 56.53,12.4 58.28,14.15 64.89,14.15 65.89,13.15 65.89,5.41 65.08,4.59 JP3.4 | v55.13,72.41 54.13,72.41 52.13,70.41 52.13,66.38 JP1.12
SWO  (via drill 0.35)
  Top 0.152: J3.B13 49.13,59.66 52.13,62.66 52.13,66.38 JP1.13 53.31,70.16 66.39,70.16 68.14,68.41 68.14,63.16 67.39,62.41 67.39,34.16 65.64,32.41 61.88,32.41 60.38,30.91 60.38,12.71 JP4.1 | X3.10 37.32,9.97 v37.13,10.15
  Bottom 0.152: v37.13,10.15 37.88,10.15 39.2,11.46 59.13,11.46 JP4.1
TXLED
  Top 0.254: U1.23 40.22,27.53 40.22,28.05 38.86,29.41 31.64,29.41 TX.C
USB_D+
  Top 0.254: U1.15 45.38,27.47 45.38,23.2 47.66,20.93 47.66,9.58 X2.D+
USB_D-
  Top 0.254: U1.16 44.72,23.07 46.88,20.91 46.88,9.55 X2.D-
VCC  (via drill 0.35, 0.8)
  Top 0.152: X3.1 25.32,8.01 F1.2 | v26.25,10.05 26.25,13.75 26.24,13.76
  Top 0.254: 62.13,59.16 62.13,66.66 | 61.12,67.67 JP1.5 | 63.01,67.53 63.16,67.67 JP1.3 | 45.38,16.91 46.13,17.66 46.13,20.91 44.07,22.97 U1.17 44.07,28.72 | 27.39,28.91 28.89,30.41 42.38,30.41 44.07,28.72 | 44.07,28.72 44.51,29.16 52.13,29.16 53.17,28.11 R5.2 R6.2
  Top 0.305: U1.4 38.87,18.92 39.88,17.91 44.38,17.91 45.38,16.91 45.45,16.84 C1.1
  Top 0.406: JP2.5 60.99,44.8 | 60.99,44.8 59.13,46.66 J3.A5 J3.B5 59.13,55.91 62.13,58.91 62.13,66.66 | 61.12,67.67 62.13,66.66 | 62.13,66.66 63.01,67.53 | JP2.3 63.53,42.26 60.99,44.8
  Top 0.813: R3.2 11.76,9.89 11.76,9.79 13.9,7.66 20.45,7.66 22.55,9.77 F1.2 23.25,10.77 26.24,13.76 27.39,14.9 27.39,28.91 23.89,32.41 6.38,32.41 5.63,33.16 v5.63,38.41
  Bottom 0.152: JP3.1 61.8,10.13 61.8,9.05 61.2,8.45 58.3,8.45 57.5,9.25 57.5,10 56.75,10.75 39.5,10.75 37,8.25 27.5,8.25 26.25,9.5 v26.25,10.05
  Bottom 0.813: v5.63,38.41 7.38,40.16 60.13,40.16 | JP2.5 60.99,39.3 60.13,40.16 | 60.13,40.16 62.88,40.16 63.53,39.51 JP2.3
VIN
  Top 0.813: U3.3 17.73,24.32 15.66,26.38 C3.1 10.3,27.48 8.88,28.91 5.13,28.91 4.13,27.91 4.13,18.66 | U2.3 17.36,12.18 14.94,14.61 C4.1 10.37,16.93 8.63,18.66 4.13,18.66 | 4.13,18.66 4.13,9.4 5.13,8.4 8.44,8.4 D1.C

### Text on the board
tNames: MOSI | SCL_2 | SWDIO | SWCLK | CAN H | 3V3 | 3V3 | 5V | GND | GND | GND | MISO_2 | SCLK_2 | SDA_2 | SDA_1 | SCLK_1 | SWDIO | CAN L | SS_1 | 3V3 | 3V3 | 5V | GND | GND | GND | MOSI_1 | NRST | Genus Main Board Dev v.1.0 | TX | RX | St-Link | Power
bNames: SS_2